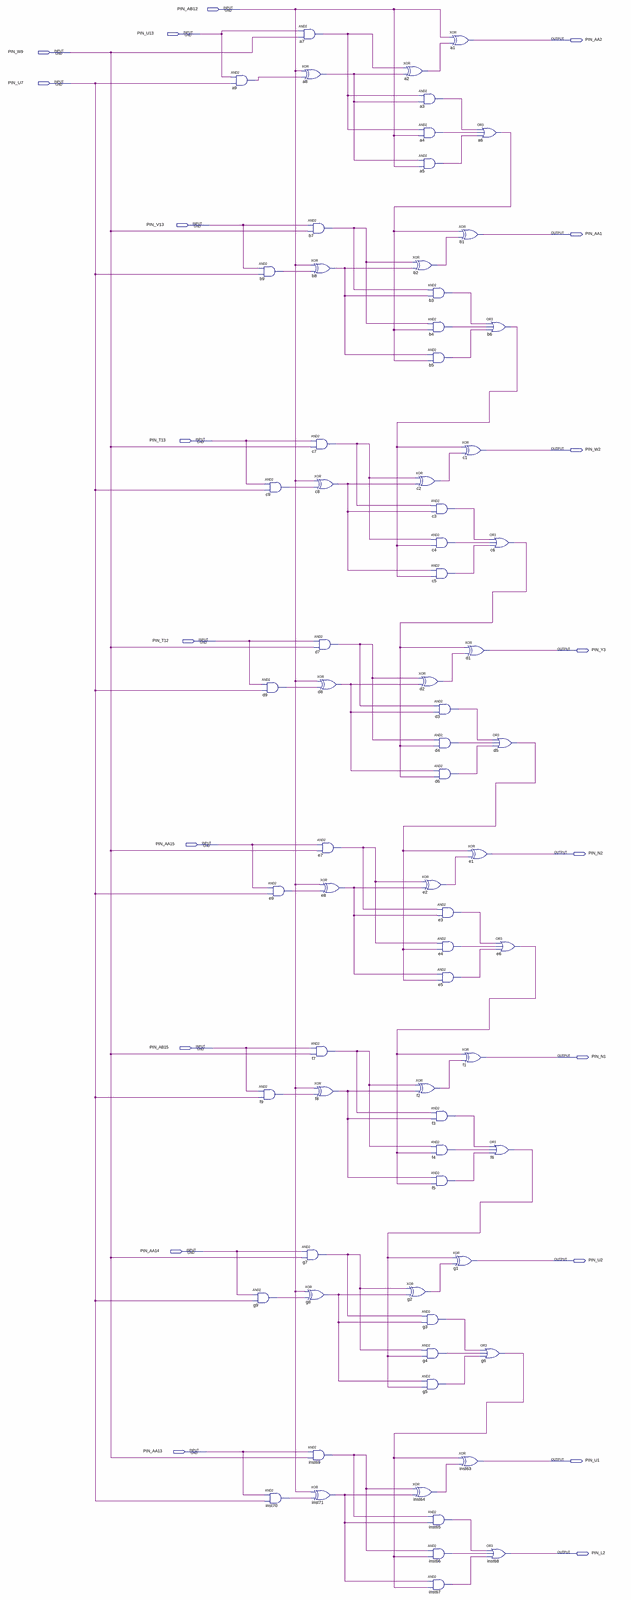
[diagram p0: schematic sheet, whole]
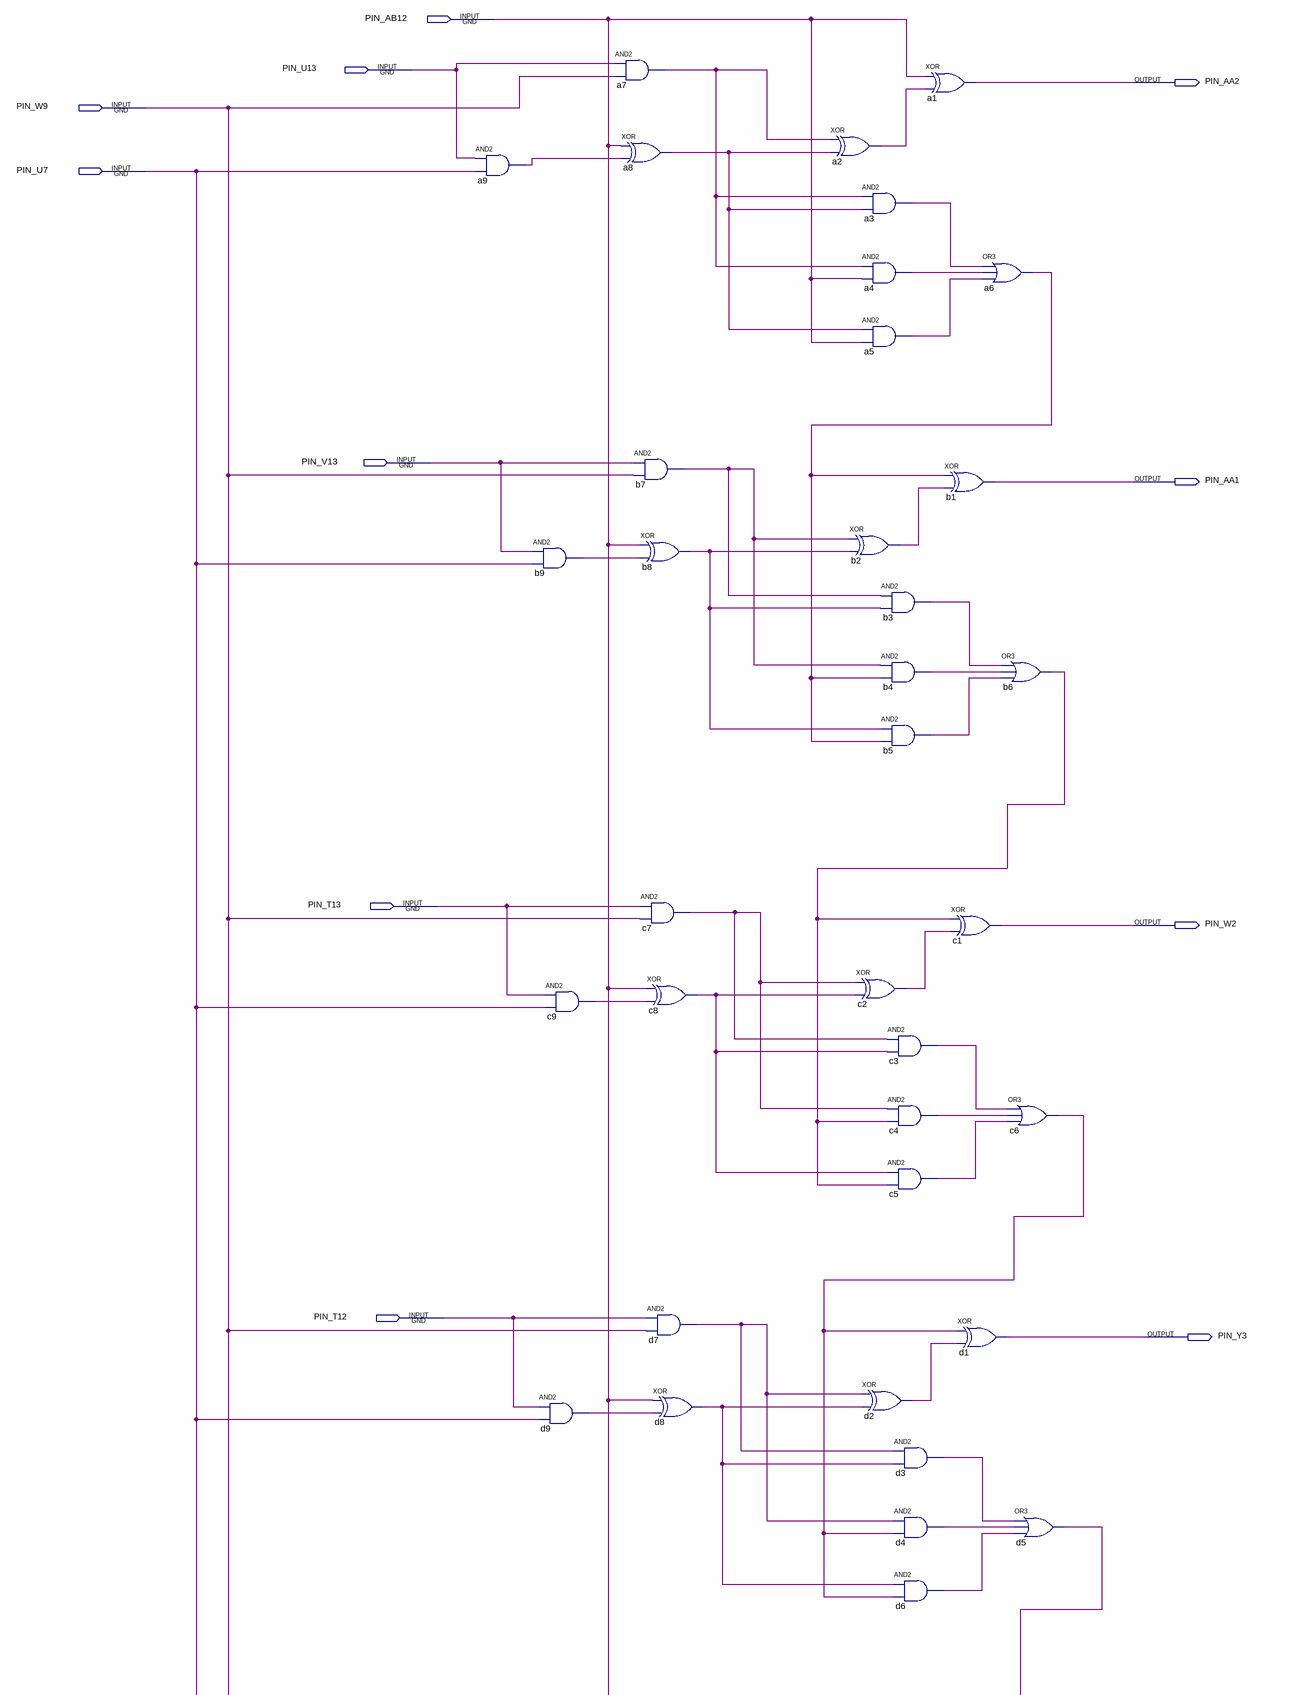
[diagram p1: schematic sheet, upper part]
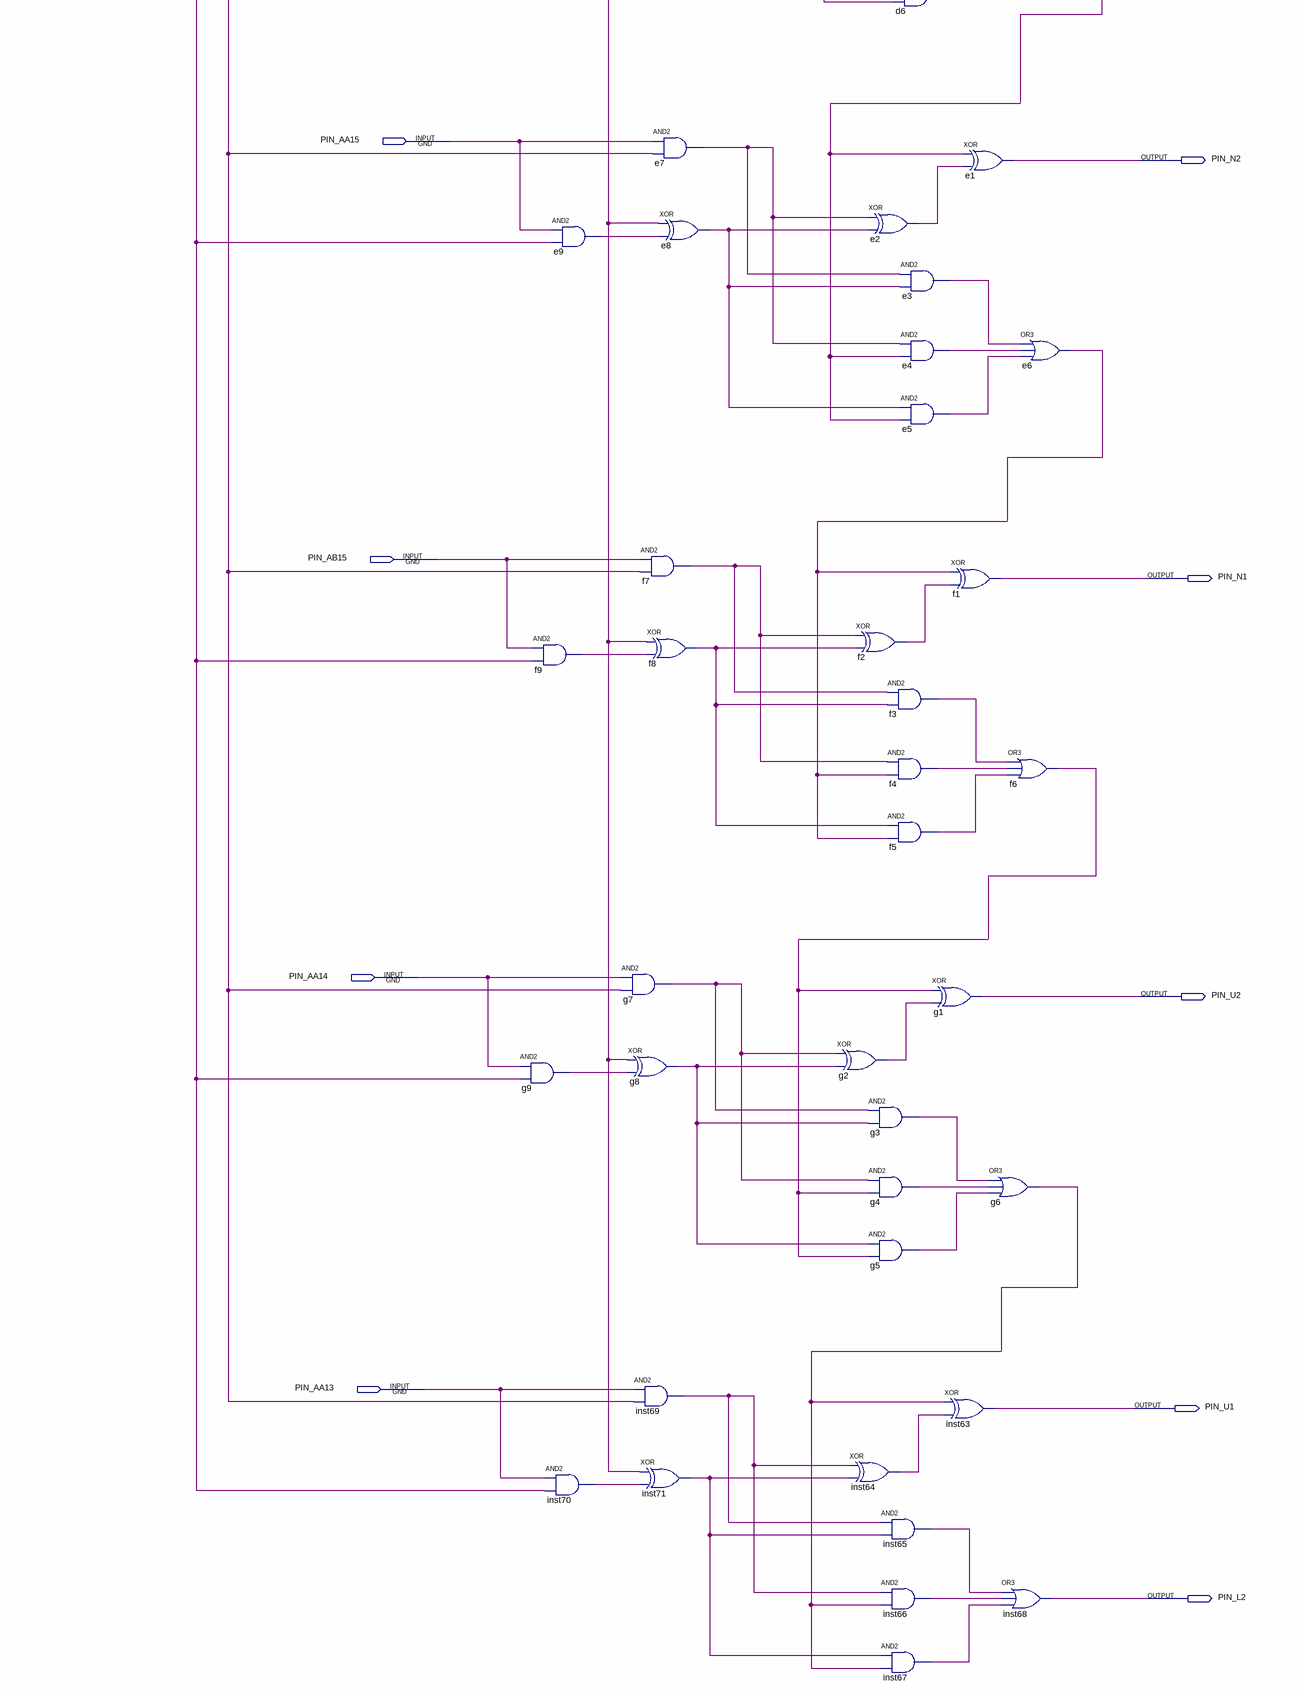
[diagram p2: schematic sheet, lower part]
// Quartus schematic 8-BitAdder2.bdf as structural Verilog: 72 symbols, 20 pins
module \8-BitAdder2  (
  input  PIN_AB12,
  input  PIN_U13,
  input  PIN_W9,
  input  PIN_U7,
  input  PIN_V13,
  input  PIN_T13,
  input  PIN_T12,
  input  PIN_AA15,
  input  PIN_AB15,
  input  PIN_AA14,
  input  PIN_AA13,
  output PIN_AA2,
  output PIN_AA1,
  output PIN_W2,
  output PIN_Y3,
  output PIN_N2,
  output PIN_N1,
  output PIN_U2,
  output PIN_U1,
  output PIN_L2
);

  wire a2_out, a3_out, a4_out, a5_out, a6_out, a7_out, a8_out, a9_out, b2_out, b3_out, b4_out, b5_out,
       b6_out, b7_out, b8_out, b9_out, c2_out, c3_out, c4_out, c5_out, c6_out, c7_out, c8_out, c9_out,
       d2_out, d3_out, d4_out, d5_out, d6_out, d7_out, d8_out, d9_out, e2_out, e3_out, e4_out, e5_out,
       e6_out, e7_out, e8_out, e9_out, f2_out, f3_out, f4_out, f5_out, f6_out, f7_out, f8_out, f9_out,
       g2_out, g3_out, g4_out, g5_out, g6_out, g7_out, g8_out, g9_out, inst64_out, inst65_out, inst66_out,
       inst67_out, inst69_out, inst70_out, inst71_out;

  and a9 (a9_out, PIN_U13, PIN_U7);
  and b9 (b9_out, PIN_V13, PIN_U7);
  and c9 (c9_out, PIN_T13, PIN_U7);
  and d9 (d9_out, PIN_T12, PIN_U7);
  and e9 (e9_out, PIN_AA15, PIN_U7);
  and f9 (f9_out, PIN_AB15, PIN_U7);
  and g9 (g9_out, PIN_AA14, PIN_U7);
  and inst70 (inst70_out, PIN_AA13, PIN_U7);
  and a7 (a7_out, PIN_U13, PIN_W9);
  xor a8 (a8_out, PIN_AB12, a9_out);
  and b7 (b7_out, PIN_V13, PIN_W9);
  xor b8 (b8_out, PIN_AB12, b9_out);
  and c7 (c7_out, PIN_T13, PIN_W9);
  xor c8 (c8_out, PIN_AB12, c9_out);
  and d7 (d7_out, PIN_T12, PIN_W9);
  xor d8 (d8_out, PIN_AB12, d9_out);
  and e7 (e7_out, PIN_AA15, PIN_W9);
  and f7 (f7_out, PIN_AB15, PIN_W9);
  xor f8 (f8_out, PIN_AB12, f9_out);
  and g7 (g7_out, PIN_AA14, PIN_W9);
  xor g8 (g8_out, PIN_AB12, g9_out);
  and inst69 (inst69_out, PIN_AA13, PIN_W9);
  xor inst71 (inst71_out, PIN_AB12, inst70_out);
  xor e8 (e8_out, PIN_AB12, e9_out);
  xor a2 (a2_out, a7_out, a8_out);
  xor b2 (b2_out, b7_out, b8_out);
  xor c2 (c2_out, c7_out, c8_out);
  xor f2 (f2_out, f7_out, f8_out);
  xor g2 (g2_out, g7_out, g8_out);
  xor inst64 (inst64_out, inst69_out, inst71_out);
  and a3 (a3_out, a7_out, a8_out);
  and a4 (a4_out, a7_out, PIN_AB12);
  and a5 (a5_out, a8_out, PIN_AB12);
  and b3 (b3_out, b7_out, b8_out);
  and b4 (b4_out, b7_out, a6_out);
  and b5 (b5_out, b8_out, a6_out);
  and c3 (c3_out, c7_out, c8_out);
  and c4 (c4_out, c7_out, b6_out);
  and c5 (c5_out, c8_out, b6_out);
  xor d2 (d2_out, d7_out, d8_out);
  and d3 (d3_out, d7_out, d8_out);
  and d4 (d4_out, d7_out, c6_out);
  and d6 (d6_out, d8_out, c6_out);
  xor e2 (e2_out, e7_out, e8_out);
  and e3 (e3_out, e7_out, e8_out);
  and e4 (e4_out, e7_out, d5_out);
  and e5 (e5_out, e8_out, d5_out);
  and f3 (f3_out, f7_out, f8_out);
  and f4 (f4_out, f7_out, e6_out);
  and f5 (f5_out, f8_out, e6_out);
  and g3 (g3_out, g7_out, g8_out);
  and g4 (g4_out, g7_out, f6_out);
  and g5 (g5_out, g8_out, f6_out);
  and inst65 (inst65_out, inst69_out, inst71_out);
  and inst66 (inst66_out, inst69_out, g6_out);
  and inst67 (inst67_out, inst71_out, g6_out);
  xor a1 (PIN_AA2, PIN_AB12, a2_out);
  xor b1 (PIN_AA1, a6_out, b2_out);
  xor c1 (PIN_W2, b6_out, c2_out);
  xor d1 (PIN_Y3, c6_out, d2_out);
  xor f1 (PIN_N1, e6_out, f2_out);
  xor g1 (PIN_U2, f6_out, g2_out);
  xor inst63 (PIN_U1, g6_out, inst64_out);
  or a6 (a6_out, a3_out, a4_out, a5_out);
  or b6 (b6_out, b3_out, b4_out, b5_out);
  or c6 (c6_out, c3_out, c4_out, c5_out);
  xor e1 (PIN_N2, d5_out, e2_out);
  or f6 (f6_out, f3_out, f4_out, f5_out);
  or g6 (g6_out, g3_out, g4_out, g5_out);
  or inst68 (PIN_L2, inst65_out, inst66_out, inst67_out);
  or d5 (d5_out, d3_out, d4_out, d6_out);
  or e6 (e6_out, e3_out, e4_out, e5_out);
endmodule
